# EAGLE design gripper board (EAGLE 7.7.0)
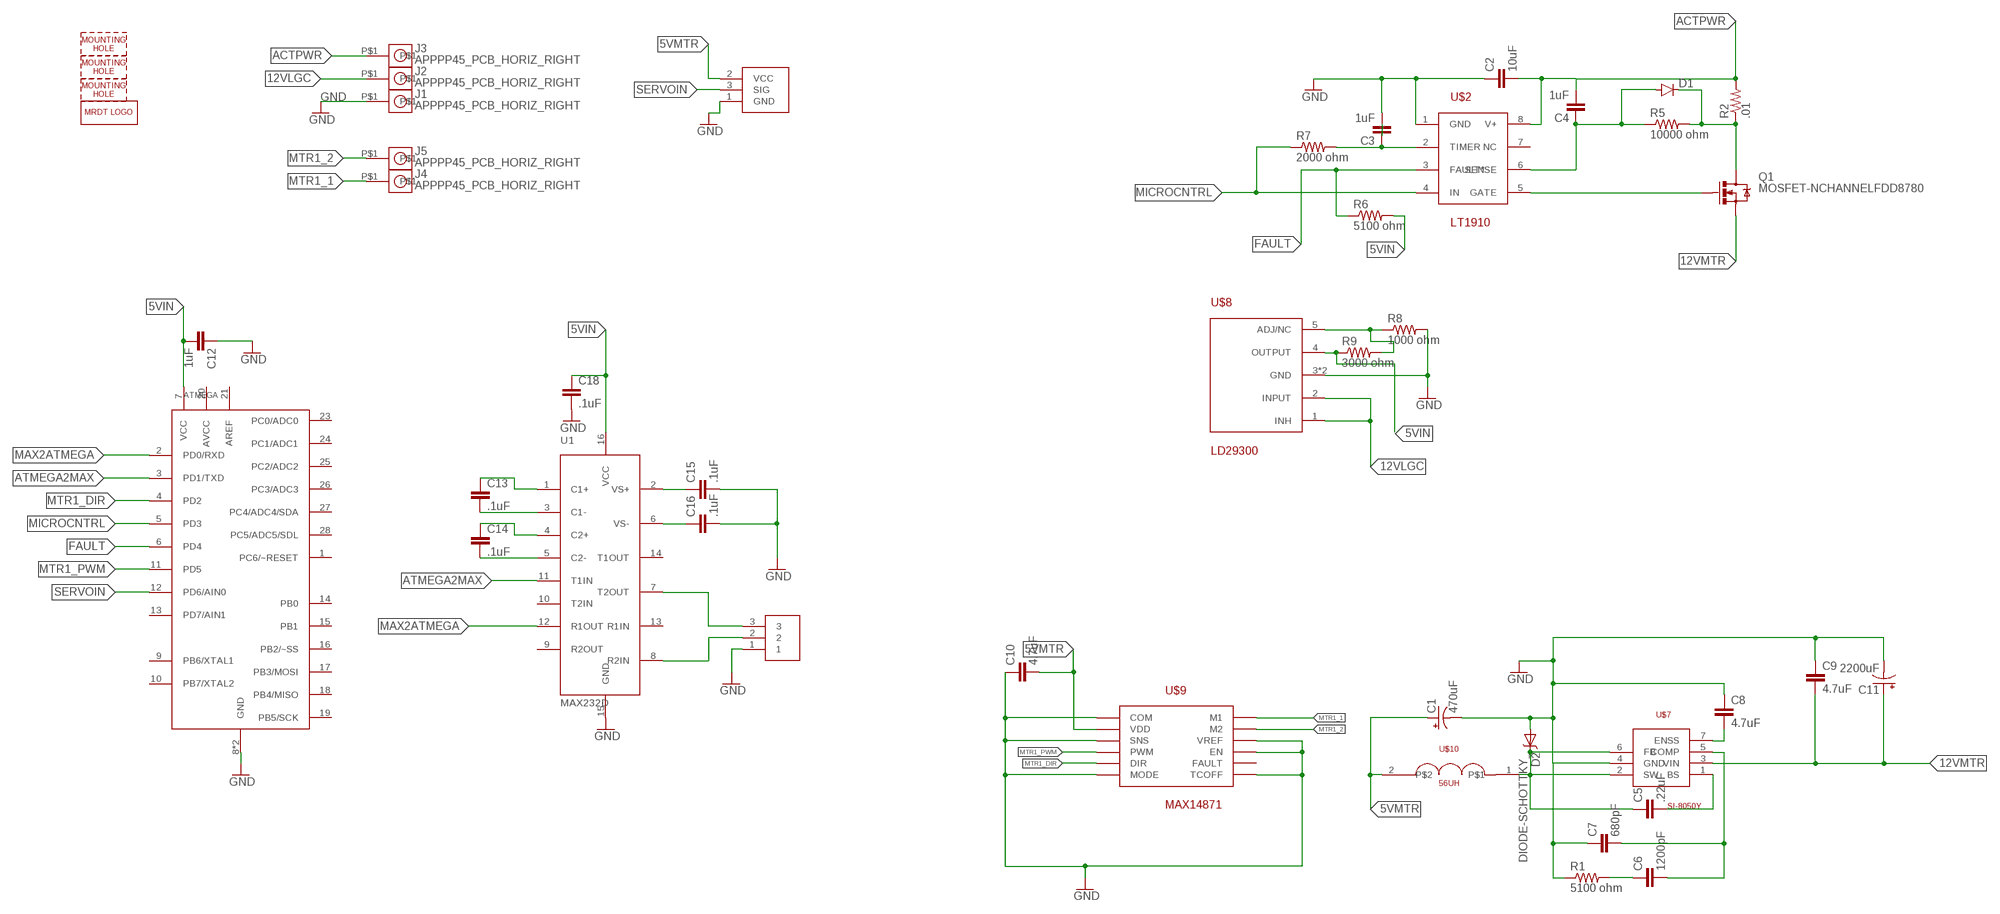
[diagram p0: schematic, sheet 1]

## Parts
ATMEGA  Q_ATMEGA328P  [DIP28]
C1  470uF  100UF-ELECT  [PANASONIC_H13]
C2  10uF  CAP0603-CAP  [0603-CAP]
C3  1uF  CAP0603-CAP  [0603-CAP]
C4  1uF  CAP0603-CAP  [0603-CAP]
C5  .22uF  1.0UF50V10%(1206)  [1206]
C6  1200pF  1.0UF50V10%(1206)  [1206]
C7  680pF  1.0UF50V10%(1206)  [1206]
C8  4.7uF  1.0UF50V10%(1206)  [1206]
C9  4.7uF  1.0UF50V10%(1206)  [1206]
C10  4.7uF  1.0UF50V10%(1206)  [1206]
C11  2200uF  C_108CKH050M  [C_16MM]
C12  1uF  CAP0603-CAP  [0603-CAP]
C13  .1uF  22UF-6.3V-20%(0805)  [0805]
C14  .1uF  22UF-6.3V-20%(0805)  [0805]
C15  .1uF  22UF-6.3V-20%(0805)  [0805]
C16  .1uF  22UF-6.3V-20%(0805)  [0805]
C18  .1uF  22UF-6.3V-20%(0805)  [0805]
D1  DIODESMA  [SMA-DIODE]
D2  DIODE-SCHOTTKY_  [SMA-DIODE]
H1  MOUNTING_HOLE#4  [#4_SCREW]
H2  MOUNTING_HOLE#4  [#4_SCREW]
H3  MOUNTING_HOLE#4  [#4_SCREW]
J1  APPPP45_PCB_HORIZ_RIGHT  [APP45_PCB_HORIZ_RIGHT]
J2  APPPP45_PCB_HORIZ_RIGHT  [APP45_PCB_HORIZ_RIGHT]
J3  APPPP45_PCB_HORIZ_RIGHT  [APP45_PCB_HORIZ_RIGHT]
J4  APPPP45_PCB_HORIZ_RIGHT  [APP45_PCB_HORIZ_RIGHT]
J5  APPPP45_PCB_HORIZ_RIGHT  [APP45_PCB_HORIZ_RIGHT]
J6  SL03  [MOLEX-70543-0002]
LOGO1  MRDT_LOGO  [MRDT_LOGO]
Q1  MOSFET-NCHANNELFDD8780  [DPAK]
R1  5100 ohm  RESISTOR0603-RES  [0603-RES]
R2  .01  RESISTOR1206  [1206]
R5  10000 ohm  RESISTOR0603-RES  [0603-RES]
R6  5100 ohm  RESISTOR0603-RES  [0603-RES]
R7  2000 ohm  RESISTOR0603-RES  [0603-RES]
R8  1000 ohm  RESISTOR0603-RES  [0603-RES]
R9  3000 ohm  RESISTOR0603-RES  [0603-RES]
U1  MAX232D  [SOIC16]
U$1  SERVOMOLEX_SL_VERT_TH  [MOLEX-70543-0002]
U$2  LT1910  [SOIC8]
U$7  SI-8050Y  [TO-220-7]
U$8  LD29300  [P2PAK]
U$9  MAX14871  [TSSOP-16]
U$10  56UH  [1210]

## Nets
5VIN: ATMEGA.7(VCC) C12.2 C18.1 R6.2 R9.1 U1.16(VCC) U$8.4(OUTPUT)
5VMTR: C1.+ C10.2 U$1.2(VCC) U$9.4(VDD) U$9.13(VDD) U$10.2
12VLGC: J2.P$1 U$8.1(INH) U$8.2(INPUT)
12VMTR: C9.2 C11.+ Q1.3(S) U$7.3(VIN)
ACTPWR: C2.2 C4.2 J3.P$1 R2.2 U$2.8(V+)
ATMEGA2MAX: ATMEGA.3(PD1/TXD) U1.11(T1IN)
FAULT: ATMEGA.6(PD4) R6.1 U$2.3(FAULT*)
GND: ATMEGA.8(GND) ATMEGA.22(GND) C1.- C2.1 C3.2 C7.1 C8.1 C9.1 C10.1 C11.GND(-) C12.1 C15.2 C16.2 C18.2 D2.A J1.P$1 J6.1 R1.1 R8.2 U1.15(GND) U$1.1(GND) U$2.1(GND) U$7.4(GND) U$8.3(GND) U$8.P$1(GND) U$9.1(COM) U$9.5(SNS) U$9.8(MODE) U$9.9(TCOFF) U$9.11(EN) U$9.12(VREF) U$9.16(COM)
MAX2ATMEGA: ATMEGA.2(PD0/RXD) U1.12(R1OUT)
MICROCNTRL: ATMEGA.5(PD3) R7.1 U$2.4(IN)
MTR1_1: J4.P$1 U$9.2(M1) U$9.3(M1)
MTR1_2: J5.P$1 U$9.14(M2) U$9.15(M2)
MTR1_DIR: ATMEGA.4(PD2) U$9.7(DIR)
MTR1_PWM: ATMEGA.11(PD5) U$9.6(PWM)
N$1: C3.1 R7.2 U$2.2(TIMER)
N$3: R8.1 R9.2 U$8.5(ADJ/NC)
N$4: C13.2 U1.3(C1-)
N$5: C6.1 R1.2
N$6: C4.1 D1.A R5.1 U$2.6(SENSE)
N$7: Q1.1(G) U$2.5(GATE)
N$8: C8.2 U$7.7(ENSS)
N$9: D1.C Q1.4(D) R2.1 R5.2
N$10: C6.2 C7.2 U$7.5(COMP)
N$12: C5.2 U$7.1(BS)
N$13: C14.2 U1.5(C2-)
N$14: C14.1 U1.4(C2+)
N$15: C13.1 U1.1(C1+)
N$16: C15.1 U1.2(VS+)
N$17: C16.1 U1.6(VS-)
N$18: J6.3 U1.7(T2OUT)
N$19: J6.2 U1.8(R2IN)
N$20: C5.1 D2.C U$7.2(SW) U$7.6(FB) U$10.1
SERVOIN: ATMEGA.12(PD6/AIN0) U$1.3(SIG)
Unconnected: ATMEGA.1(PC6/~RESET) ATMEGA.9(PB6/XTAL1) ATMEGA.10(PB7/XTAL2) ATMEGA.13(PD7/AIN1) ATMEGA.14(PB0) ATMEGA.15(PB1) ATMEGA.16(PB2/~SS) ATMEGA.17(PB3/MOSI) ATMEGA.18(PB4/MISO) ATMEGA.19(PB5/SCK) ATMEGA.20(AVCC) ATMEGA.21(AREF) ATMEGA.23(PC0/ADC0) ATMEGA.24(PC1/ADC1) ATMEGA.25(PC2/ADC2) ATMEGA.26(PC3/ADC3) ATMEGA.27(PC4/ADC4/SDA) ATMEGA.28(PC5/ADC5/SDL) U1.9(R2OUT) U1.10(T2IN) U1.13(R1IN) U1.14(T1OUT) U$2.7(NC) U$9.10(FAULT)

## Library data of the parts
ATMEGA = MRDT-2014-All:Q_ATMEGA328P: ATMEGA 328P in 28PIN PDIP package
C1 = SparkFun-Capacitors:100UF-ELECT: 100uF electrolytic SMT CAP-08362- 63V 20%; PROD_ID: CAP-08362; VALUE: 100uF
C2-C4 C12 = SparkFun-Capacitors:CAP: Capacitor Standard 0603 ceramic capacitor, and 0.1" leaded capacitor.
C5-C10 = MRDT-EAGLE-Training:1.0UF50V10%(1206): CAP-09822; PROD_ID: CAP-09822; VALUE: 1.0uF
C11 = MRDT-2014-All:C_108CKH050M: CAP ALUM 50V 0.1mF 1.1A ripple
C13-C16 C18 = SparkFun-Capacitors:22UF-6.3V-20%(0805): Ceramic CAP-08402; PROD_ID: CAP-08402; VALUE: 22uF
D1 = MRDT-EAGLE-Training:DIODE: Diode These are standard reverse protection diodes and small signal diodes. SMA package can handle up to about 1A. SOD-323 can handle about 200mA. What the SOD-323 package when ordering, there are some mfgs out there that are 5-pin packages.
D2 = SparkFun-DiscreteSemi:DIODE-SCHOTTKY: Commonly MBRA140.
H1-H3 = MRDT-Hardware:MOUNTING_HOLE: Mounting hole for M6 bolt. Standard use mounting hole for: Tiva C Connected - M6 Anderson Powerpole Mounting Wing - M8 Most frame-mounted PCB's - M8
J1-J5 = MRDT-Connectors:APP: http://www.powerwerx.com/anderson-powerpoles/
J6 = MRDT-Connectors:SL03: Molex 3-pin SL connector Locking 3 pin connector with standard header spacing. Backward compatible with standard RC servo connectors.
LOGO1 = MRDT-Hardware:MRDT_LOGO
Q1 = SparkFun-DiscreteSemi:MOSFET-NCHANNEL: Common NMOSFET Parts MFG P/N Store ID Prod ID FDD8780 TRANS-09984 SI7820DN TRANS-11055 FDS6630A IC-08089 2N7002PW TRANS-11151 FQP30N06L COM-10213 TRANS-10060 BSS123LT1G TRANS-08345 BSS138 TRANS-00830 BS170 2N7000; PROD_ID: TRANS-09984
R1 R5-R9 = SparkFun-Passives:RESISTOR: Resistor Basic schematic elements and footprints for 0603, 1206, and PTH resistors.
R2 = SparkFun-Resistors:RESISTOR: Resistor Basic schematic elements and footprints for 0603, 1206, and PTH resistors.
U1 = MRDT-ICs:MAX*232; OPERATING_VOLTAGE: 5V
U$1 = MRDT-Connectors:SERVO
U$2 = mylib1:LT1910: Transistor driver with internal current sensing
U$7 = opamps:SI-8050Y
U$8 = mylib1:LD29300
U$9 = tssopep:MAX14871: H bridge IC http://www.digikey.com/product-detail/en/maxim-integrated/MAX14871EUE-T/MAX14871EUE-CT-ND/5129512
U$10 = SparkFun-Capacitors:56UH

## Board
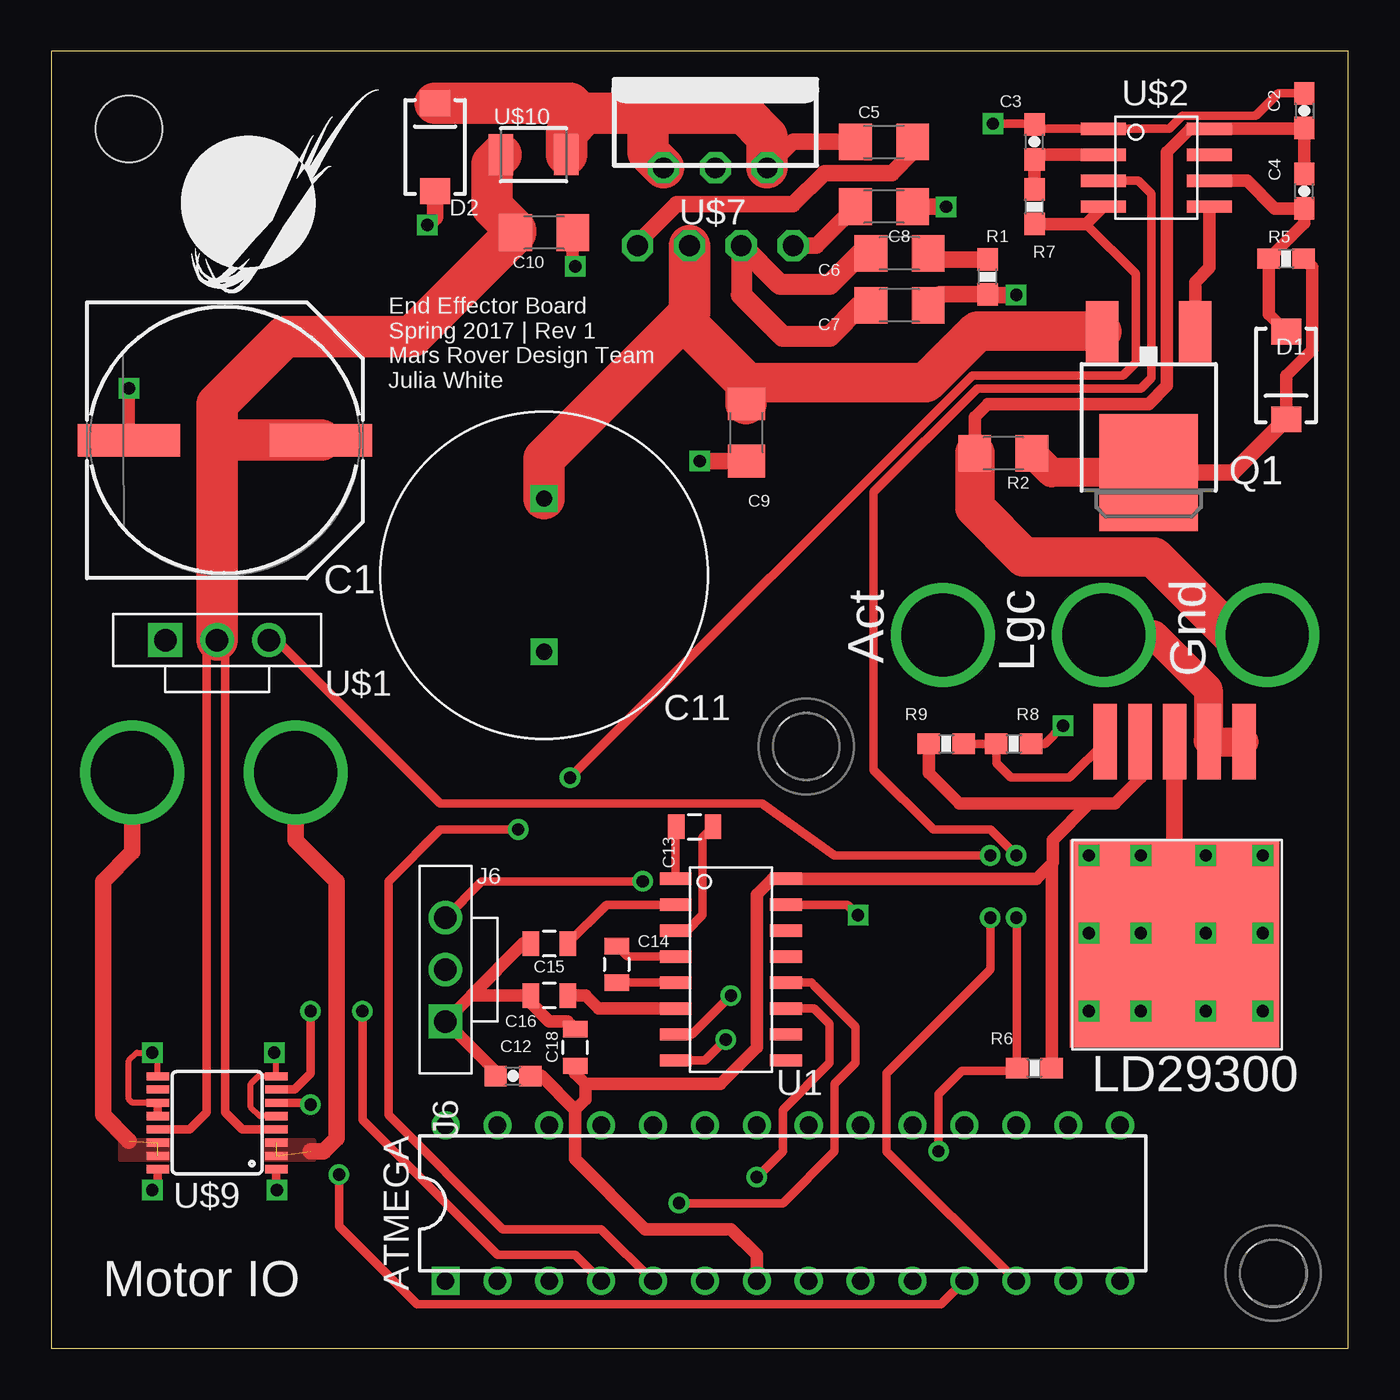
[diagram p1: board, top side]
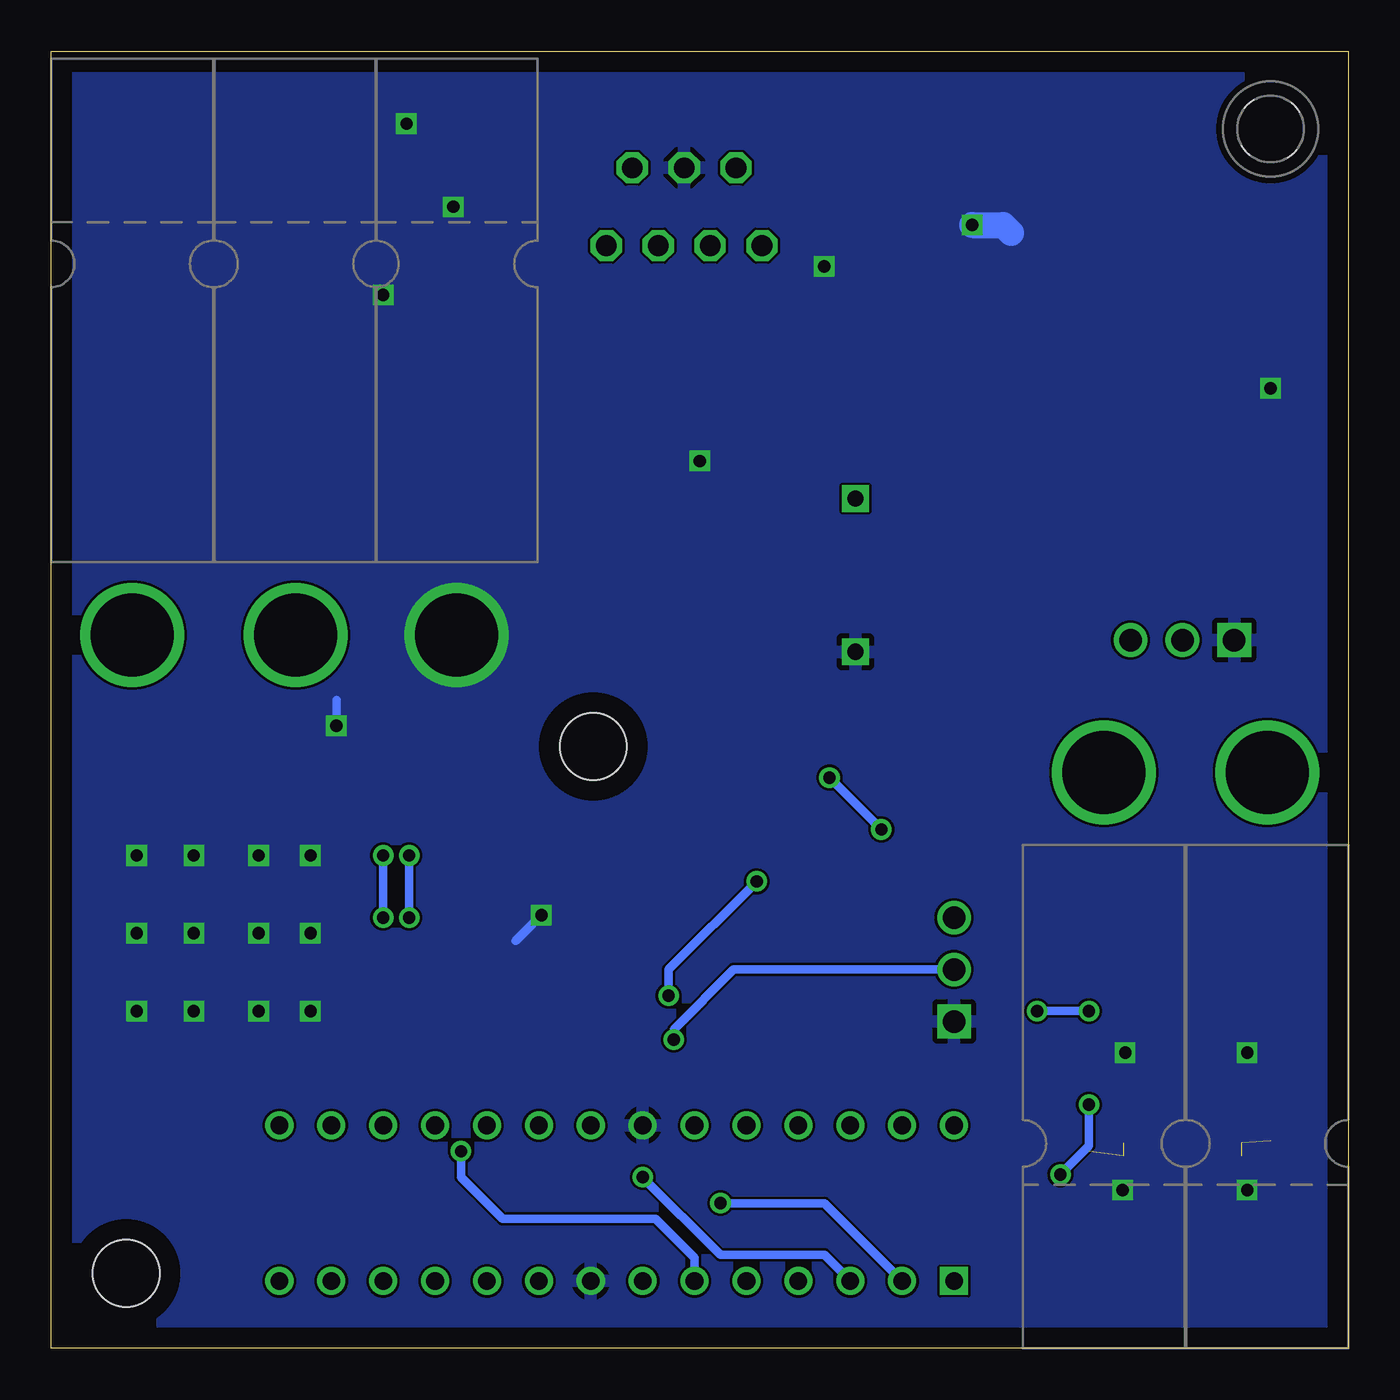
[diagram p2: board, bottom side, seen from below]

Size 63.5 x 63.5 mm. Coordinates in mm from the lower left corner, seen from the top.
Outline: 0,0 63.5,0 63.5,63.5 0,63.5 0,0
Copper layers (1*16): Top 0.035mm / dielectric 1.5mm / Bottom 0.035mm
Design rules "advanced_circuits_standard": minimum track width 5mil, minimum drill 10mil, track to track 5mil, track to pad 5mil, pad to pad 5mil, via to via 5mil, smd to smd 5mil, copper to edge 40mil, drill to drill 5mil, minimum pad ring 10mil, minimum via ring 8mil, stop-mask expansion 4mil, vias tented up to drill 0mil, thermal gap 10mil

### Footprints (pad centres in the part's own frame; a part is rotated, then mirrored left to right if it is on the bottom)
DIP28 = drill 0.864 square: 1 -16.51,-3.81 | drill 0.864: 2 -13.97,-3.81; 3 -11.43,-3.81; 4 -8.89,-3.81; 5 -6.35,-3.81; 6 -3.81,-3.81; 7 -1.27,-3.81; 8 1.27,-3.81; 9 3.81,-3.81; 10 6.35,-3.81; 11 8.89,-3.81; 12 11.43,-3.81; 13 13.97,-3.81; 14 16.51,-3.81; 15 16.51,3.81; 16 13.97,3.81; 17 11.43,3.81; 18 8.89,3.81; 19 6.35,3.81; 20 3.81,3.81; 21 1.27,3.81; 22 -1.27,3.81; 23 -3.81,3.81; 24 -6.35,3.81; 25 -8.89,3.81; 26 -11.43,3.81; 27 -13.97,3.81; 28 -16.51,3.81
PANASONIC_H13 = smd 5 x 1.6: + 4.7,0; - -4.7,0
0603-CAP = smd 1.1 x 1: 1 -0.85,0; 2 0.85,0
1206 = smd 1.6 x 1.8: 1 -1.4,0; 2 1.4,0
C_16MM = drill 0.8 square: + 0,3.75; GND 0,-3.75
0805 = smd 0.8 x 1.2: 1 -0.9,0; 2 0.9,0
SMA-DIODE = smd 1.27 x 1.47: A -2.15,0; C 2.15,0
#4_SCREW = hole 3.264: 0,0
APP45_PCB_HORIZ_RIGHT = drill 4.064: P$1 28.194,3.969
MOLEX-70543-0002 = drill 1.1 square: 1 2.54,0 | drill 1.1: 2 0,0; 3 -2.54,0
DPAK = smd 1.6 x 3: 1 -2.28,-5.31; 3 2.28,-5.31 | smd 4.826 x 5.715: 4 0,1.588
0603-RES = smd 1.1 x 1: 1 -0.85,0; 2 0.85,0
SOIC16 = smd 0.6 x 1.55: 1 -4.445,-2.7; 2 -3.175,-2.7; 3 -1.905,-2.7; 4 -0.635,-2.7; 5 0.635,-2.7; 6 1.905,-2.7; 7 3.175,-2.7; 8 4.445,-2.7; 9 4.445,2.7; 10 3.175,2.7; 11 1.905,2.7; 12 0.635,2.7; 13 -0.635,2.7; 14 -1.905,2.7; 15 -3.175,2.7; 16 -4.445,2.7
SOIC8 = smd 2.2 x 0.6: 1 -2.6,1.905; 2 -2.6,0.635; 3 -2.6,-0.635; 4 -2.6,-1.905; 5 2.6,-1.905; 6 2.6,-0.635; 7 2.6,0.635; 8 2.6,1.905
TO-220-7 = drill 1.016 octagon: 1 -3.81,3.81; 2 0,2.54; 3 -3.81,1.27; 4 0,0; 5 -3.81,-1.27; 6 0,-2.54; 7 -3.81,-3.81
P2PAK = smd 1.15 x 3.7: 1 -3.4,-4.8; 2 -1.7,-4.8; 3 0,-4.8; 4 1.7,-4.8; 5 3.4,-4.8 | smd 10.25 x 10.16: P$1 0,5.08
TSSOP-16 = smd 0.4 x 1.1: 1 -2.275,-2.9; 2 -1.625,-2.9; 3 -0.975,-2.9; 4 -0.325,-2.9; 5 0.325,-2.9; 6 0.975,-2.9; 7 1.625,-2.9; 8 2.275,-2.9; 9 2.275,2.9; 10 1.625,2.9; 11 0.975,2.9; 12 0.325,2.9; 13 -0.325,2.9; 14 -0.975,2.9; 15 -1.625,2.9; 16 -2.275,2.9
1210 = smd 1.2 x 2: 1 -1.6,0; 2 1.6,0

### Placement (x,y rotation side)
ATMEGA  35.81,7.11 0 top
C1  8.51,44.45 0 top
C2  61.34,60.58 270 top
C3  48.13,59.05 90 top
C4  61.34,56.64 90 top
C5  40.77,59.05 0 top
C6  41.53,53.59 180 top
C7  41.53,51.05 180 top
C8  40.77,55.88 180 top
C9  34.04,44.83 90 top
C10  24.13,54.61 180 top
C11  24.13,37.85 0 top
C12  22.61,13.34 0 top
C13  31.5,25.53 0 top
C14  27.69,18.8 270 top
C15  24.38,19.81 180 top
C16  24.38,17.27 180 top
C18  25.65,14.73 90 top
D1  60.45,47.62 270 top
D2  18.8,58.8 90 top
H1  36.96,29.46 0 top
H2  3.81,59.69 0 bottom
H3  59.82,3.68 0 top
J1  47.62,63.12 270 bottom
J2  55.5,63.12 270 bottom
J3  63.5,63.12 270 bottom
J4  8,0 90 bottom
J5  0,0 90 bottom
J6  19.3,18.54 270 top
LOGO1  6.35,50.8 0 top
Q1  53.72,44.45 180 top
R1  45.85,52.45 90 top
R2  46.61,43.81 180 top
R5  60.45,53.34 0 top
R6  48.13,13.72 0 top
R7  48.13,55.88 90 top
R8  47.12,29.59 0 top
R9  43.81,29.59 0 top
U1  33.27,18.54 270 top
U$1  8.13,34.67 180 top
U$2  54.1,57.78 0 top
U$7  32.51,57.78 90 top
U$8  54.99,24.89 180 top
U$9  8.13,11.05 90 top
U$10  23.62,58.42 180 top

### Tracks (layer width: path | path; a pad name or v marks a point on that pad's centre or on a via)
5VIN
  Top 0.61: 26.16,12.95 32.77,12.95 34.54,14.73 34.54,22.23 35.31,22.99 U1.16 | 26.16,12.95 25.65,13.46 C18.1 | ATMEGA.7 34.54,4.57 33.27,5.84 29.08,5.84 25.65,9.27 25.65,11.68 | 26.16,12.95 26.16,12.19 25.65,11.68 | C12.2 24,13.34 25.65,11.68 | U1.16 35.56,22.99 | 48.98,23.75 49.02,23.79 49.02,24.89 50.8,26.67 | U1.16 48.22,22.99 48.98,23.75 | R9.1 42.97,28.16 44.45,26.67 50.8,26.67 | R6.2 48.98,23.75 | 50.8,26.67 52.07,26.67 53.34,27.94 53.34,29.64 U$8.4
5VMTR
  Top 0.406: U$9.4 9.34,10.72 8.51,11.56 8.51,34.29 U$1.2 7.62,34.16 7.62,11.56 6.79,10.72 U$9.13
  Top 0.813: 22.73,54.36 C10.2
  Top 1.422: C10.2 | 22.73,54.36 22.61,54.36
  Top 2.032: U$10.2 21.59,57.99 21.59,55.88 22.73,54.74 C10.2 17.65,49.53 11.43,49.53 8.13,46.23 8.13,44.45 | C1.+ 8.13,44.45 | U$1.2 8.13,44.45
12VLGC
  Top 1.422: J2.P$1 53.98,34.92 56.64,32.26 56.64,29.74 U$8.2 U$8.1
12VMTR
  Top 1.27: 34.02,46.25 C9.2
  Top 1.93: 34.02,47.27 42.82,47.27 45.34,49.78 51.42,49.78 Q1.3
  Top 2.032: 30.92,50.35 24.13,43.56 C11.+ | 30.92,50.35 31.24,50.67 U$7.3 | 34.02,46.25 34.02,47.27 30.92,50.35
ACTPWR
  Top 0.406: 55.75,59.69 U$2.8
  Top 0.61: 55.75,59.69 54.61,58.55 54.61,47.12 53.72,46.23 45.85,46.23 45.21,45.59 R2.2 | C4.2 C2.2 61.3,59.69 U$2.8
  Top 1.93: J3.P$1 57.78,34.92 53.98,38.73 47.62,38.73 45.21,41.15 R2.2
ATMEGA2MAX  (via drill 0.6)
  Top 0.406: v34.54,8.38 35.81,9.65 35.81,11.68 38.1,13.97 38.1,15.88 37.34,16.64 U1.11
  Bottom 0.406: ATMEGA.3 25.65,4.57 30.73,4.57 v34.54,8.38
FAULT  (via drill 0.6)
  Top 0.406: v43.43,9.65 43.43,12.45 44.58,13.59 47.16,13.59 R6.1 47.28,21.04 v47.24,21.08 | 52.2,57.15 U$2.3 53.21,57.15 53.85,56.52 53.85,47.5 53.34,46.99 45.34,46.99 40.26,41.91 40.26,28.32 43.18,25.4 45.97,25.4 v47.24,24.13
  Bottom 0.406: v43.43,9.65 43.43,8.38 41.4,6.35 33.91,6.35 32,4.45 ATMEGA.6 | v47.24,24.13 v47.24,21.08
GND  (via drill 0.6)
  Top 0.305: U$9.11 3.98,12.02 3.81,12.19 3.81,14.1 4.19,14.48 v4.95,14.48 5.23,14.2 U$9.9 | v10.92,14.48 11.03,14.37 U$9.8 11.02,13.34 10.16,13.34 9.78,12.95 9.78,11.81 10.22,11.37 U$9.5
  Top 0.406: U$9.12 U$9.11 | C8.1 42.17,56.01 | v46.1,59.94 48.09,59.94 C3.2 | C7.1 43.48,51.6 | R1.1 45.89,51.56 | 48.35,59.69 U$2.1 54.74,59.69 55.37,60.33 58.97,60.33 60.07,61.43 C2.1 | R8.2 48.64,29.59 v49.53,30.48 | U$8.3 54.99,27.56 | U1.15 38.99,21.72 v39.5,21.21 | U$9.16 5.23,8.02 v4.95,7.75 | U$9.1 11.03,7.77 v11.05,7.75 | v56.52,20.32 55.5,20.32 U$8.P$1
  Top 0.61: C18.2 25.28,16 24.38,16 23.48,16.9 C16.2 20.57,17.27 | 20.57,17.27 J6.1 21.76,13.55 C12.1 | C15.2 23.11,19.81 20.57,17.27 | C10.1 25.53,53.08 v25.65,52.96 | 48.35,59.69 C3.2 | C1.- v3.81,46.99
  Top 0.813: C9.1 v31.75,43.43 | C8.1 v43.81,55.88 | 43.48,51.6 R1.1 | 45.89,51.56 v47.24,51.56 | U$8.P$1 U$8.3 | D2.A 18.8,55.37 v18.41,54.99
  Bottom 0.406: v49.53,30.48 49.53,31.75 | v39.5,21.21 40.77,19.94
  Bottom 1.27: v18.41,54.99 16.89,54.99 16.51,54.61
  other vias: 50.8,24.13 50.8,20.32 50.8,16.51 59.31,24.13 59.31,20.32 59.31,16.51 53.34,24.13 53.34,20.32 53.34,16.51 56.52,24.13 56.52,16.51
  pour Bottom: -1.27,63.5 -1.27,-2.54 64.77,-2.54 64.77,64.77 -1.27,64.77
MAX2ATMEGA  (via drill 0.6)
  Top 0.406: v30.73,7.11 35.81,7.11 38.35,9.65 38.35,12.95 39.37,13.97 39.37,15.75 37.72,17.4 37.34,17.78 37.21,17.91 U1.12
  Bottom 0.406: ATMEGA.2 25.65,7.11 v30.73,7.11
MICROCNTRL  (via drill 0.6)
  Top 0.406: R7.1 47.97,55.03 | ATMEGA.5 26.92,5.84 22.1,5.84 16.51,11.43 16.51,22.86 19.05,25.4 v22.86,25.4 | v25.4,27.94 45.09,47.62 52.45,47.62 53.09,48.26 53.09,52.6 50.65,55.03
  Top 0.61: R7.1 50.65,55.03 U$2.4
  Bottom 0.406: v22.86,25.4 v25.4,27.94
MTR1_1  (2 unrouted)
  Top 0.813: 12.7,9.65 13.34,9.65 13.97,10.29 13.97,22.86 11.97,24.86 J4.P$1
  pour Top (no thermals): 10.54,10.16 12.83,10.16 12.83,9.27 10.54,9.27
MTR1_2  (2 unrouted)
  Top 0.813: 3.81,10.16 2.54,11.43 2.54,22.86 3.97,24.29 J5.P$1
  pour Top (no thermals): 3.43,10.16 5.84,10.16 5.84,9.27 3.43,9.27
MTR1_DIR  (via drill 0.6)
  Top 0.406: ATMEGA.4 25.65,4.57 21.84,4.57 15.24,11.18 v15.24,16.51 | v12.7,16.51 12.7,13.46 11.91,12.67 U$9.7
  Bottom 0.406: v15.24,16.51 v12.7,16.51
MTR1_PWM  (via drill 0.6)
  Top 0.406: U$9.6 12.61,12.02 v12.7,11.94 | v14.1,8.51 14.1,5.97 17.91,2.16 43.56,2.16 ATMEGA.11
  Bottom 0.406: v12.7,11.94 12.7,9.91 v14.1,8.51
N$1
  Top 0.61: R7.2 C3.1 48.35,58.42 U$2.2
N$3
  Top 0.406: R9.2 R8.1 46.27,28.66 46.99,27.94 49.84,27.94 U$8.5
N$4
  Top 0.406: U1.3 31.11,20.45 31.88,21.21 31.88,25.01 C13.2
N$5
  Top 0.406: R1.2 45.55,53.59
  Top 0.813: C6.1 43.22,53.3 R1.2
N$6
  Top 0.61: U$2.6 58.55,57.15 59.91,55.79 C4.1 61.34,55.08 R5.1 59.6,50.62 D1.A
N$7
  Top 0.61: U$2.5 56.7,52.89 56,52.19 Q1.1
N$8
  Top 0.813: C8.2 37.46,53.98 U$7.7
N$9
  Top 0.61: D1.C 60.45,47.62 61.72,48.9 61.72,52.92 R5.2
  Top 0.813: Q1.4 57.84,42.86 D1.C
  Top 1.422: Q1.4 48.96,42.86 R2.1
N$10
  Top 1.016: 39.88,50.8 C7.2 39.62,51.05 38.1,49.53 35.81,49.53 33.78,51.56 U$7.5 35.69,52.07 38.1,52.07 39.62,53.59 C6.2
N$12
  Top 0.813: C5.2 42.17,58.55 41.15,57.53 37.85,57.53 36.32,56.01 30.61,56.01 28.7,54.1 U$7.1
N$13
  Top 0.406: U1.5 C14.2
N$14
  Top 0.406: U1.4 28.2,19.18 C14.1
N$15
  Top 0.406: U1.1 30.57,25.5 C13.1
N$16
  Top 0.406: U1.2 27.19,21.72 C15.1
N$17
  Top 0.61: C16.1 26.16,17.27 26.8,16.64 U1.6
N$18  (via drill 0.6)
  Top 0.406: U1.7 31.37,15.37 v33.27,17.27 | J6.3 21.08,22.86 v28.96,22.86
  Bottom 0.406: v33.27,17.27 33.27,18.54 v28.96,22.86
N$19  (via drill 0.6)
  Top 0.406: U1.8 32,14.1 v33.02,15.11
  Bottom 0.406: J6.2 30.1,18.54 33.02,15.62 v33.02,15.11
N$20
  Top 0.813: U$7.6 36.32,59.05 C5.1
  Top 2.032: U$7.6 35.05,59.31 33.91,60.45 29.21,60.45 | 29.21,60.45 26.16,60.45 | 26.16,60.45 25.22,59.51 U$10.1 | U$7.2 29.21,58.55 29.21,60.45 | D2.C 25.4,60.96 25.91,60.45 26.16,60.45
SERVOIN  (via drill 0.6)
  Top 0.406: ATMEGA.12 40.89,9.65 40.89,13.46 45.97,18.54 v45.97,21.08 | v45.97,24.13 38.35,24.13 34.8,26.67 19.05,26.67 11.05,34.67 U$1.3
  Bottom 0.406: v45.97,24.13 v45.97,21.08

### Text on the board
tNames: End Effector Board / Spring 2017 | Rev 1 / Mars Rover Design Team / Julia White | Act | Lgc | Gnd | J6 | LD29300 | Motor IO